# EAGLE design Audio_Mixer_MK2_prod (EAGLE 5.11)
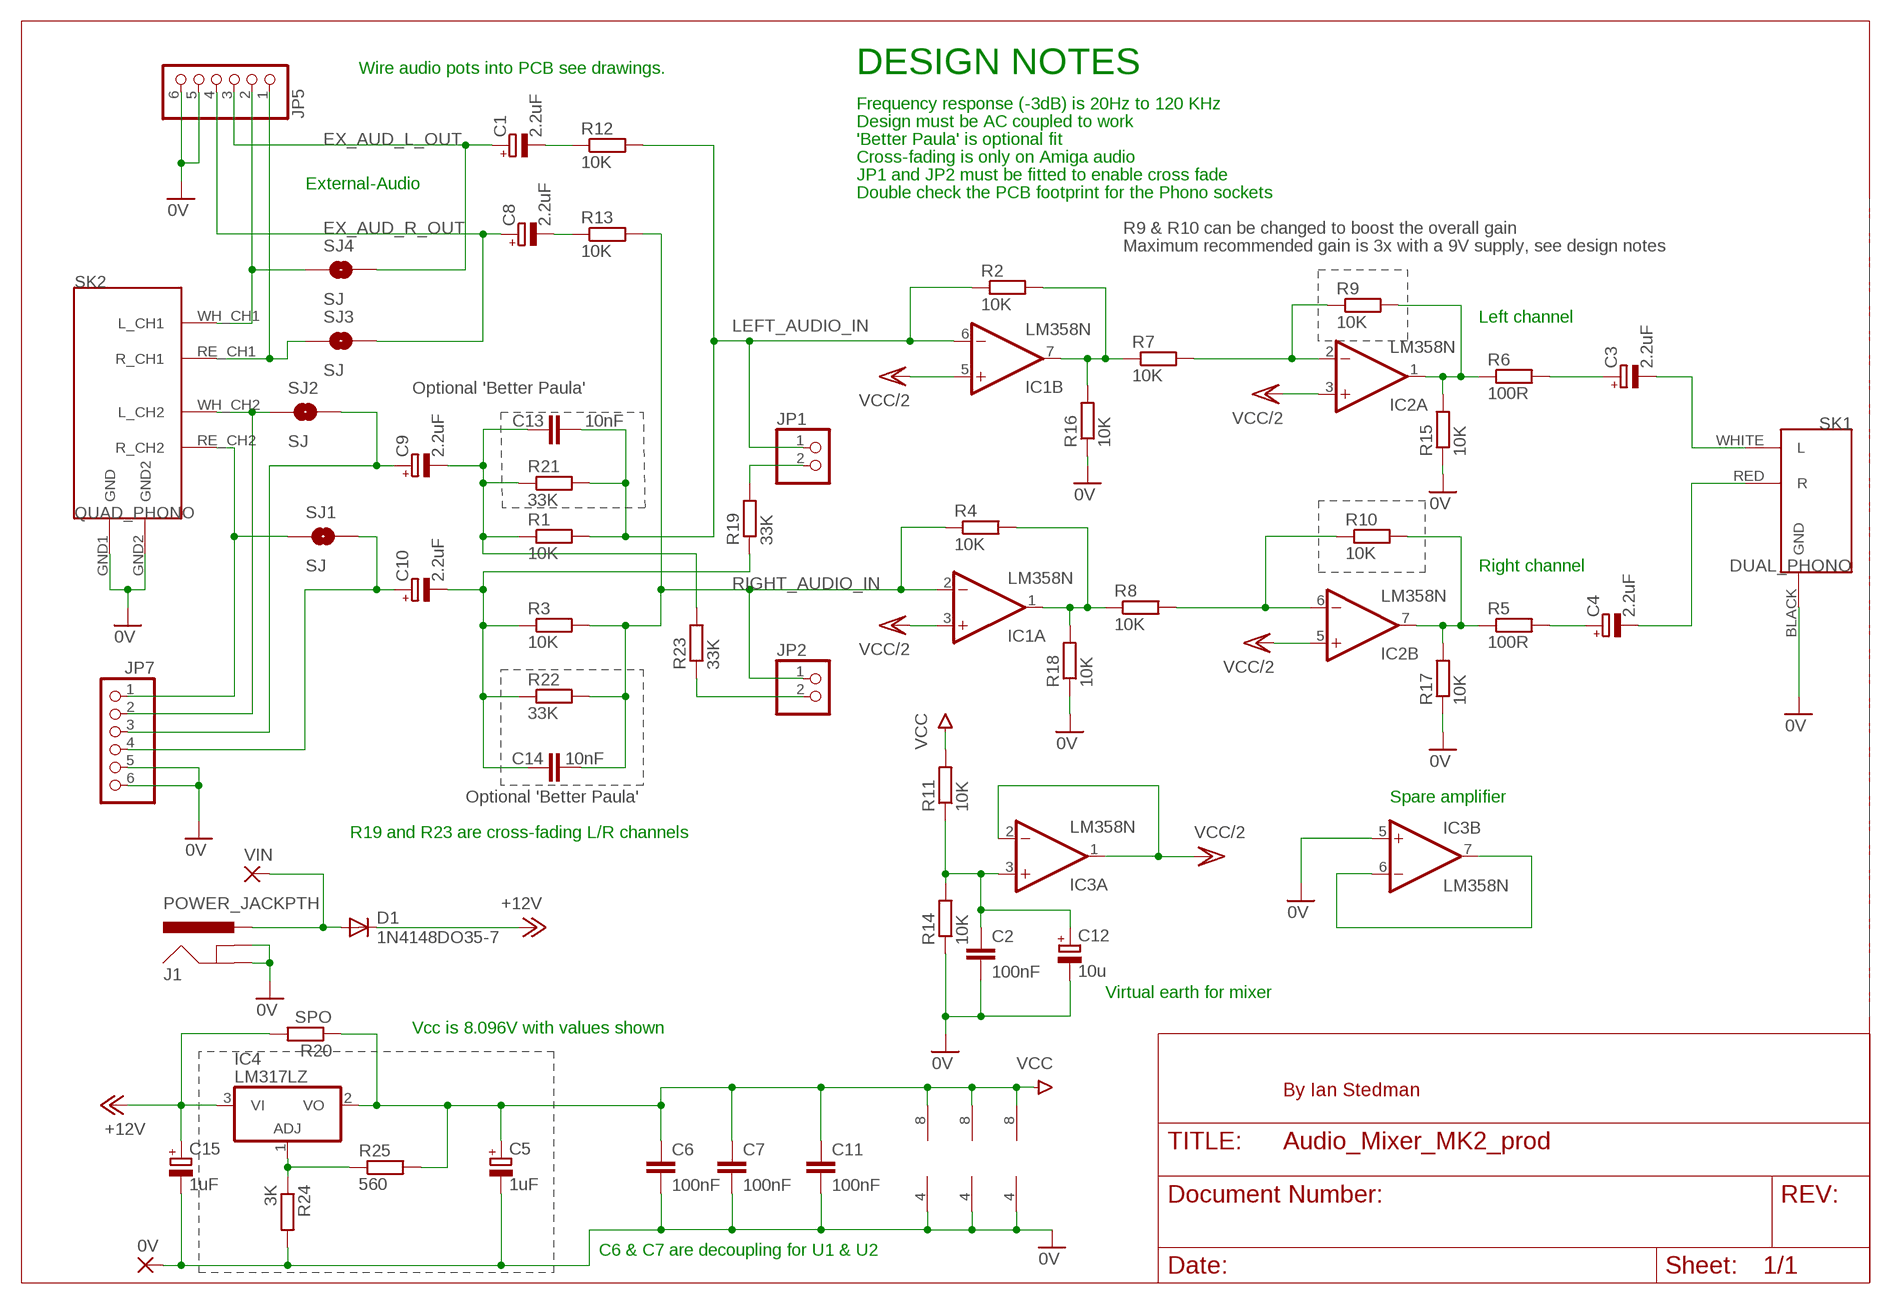
[diagram p0: schematic, sheet 1]

## Parts
0V  2,54/1,1  [2,54/1,1]
C1  2.2uF  CPOL-EUE2.5-5  [E2,5-5]
C2  100nF  C-EU050-025X075  [C050-025X075]
C3  2.2uF  CPOL-EUE2.5-5  [E2,5-5]
C4  2.2uF  CPOL-EUE2.5-5  [E2,5-5]
C5  1uF  CPOL-EUE2.5-5  [E2,5-5]
C6  100nF  C-EU050-025X075  [C050-025X075]
C7  100nF  C-EU050-025X075  [C050-025X075]
C8  2.2uF  CPOL-EUE2.5-5  [E2,5-5]
C9  2.2uF  CPOL-EUE2.5-5  [E2,5-5]
C10  2.2uF  CPOL-EUE2.5-5  [E2,5-5]
C11  100nF  C-EU050-025X075  [C050-025X075]
C12  10u  CPOL-EUE2.5-5  [E2,5-5]
C13  10nF  C-EU050-025X075  [C050-025X075]
C14  10nF  C-EU050-025X075  [C050-025X075]
C15  1uF  CPOL-EUE2.5-5  [E2,5-5]
D1  1N4148DO35-7  [DO35-7]
IC1  LM358N  [DIL08]
IC2  LM358N  [DIL08]
IC3  LM358N  [DIL08]
IC4  LM317LZ  [TO92]
J1  POWER_JACKPTH  [POWER_JACK_PTH]
JP1  PINHD-1X2  [1X02]
JP2  PINHD-1X2  [1X02]
JP5  PINHD-1X6  [1X06]
JP7  PINHD-1X6  [1X06]
R1  10K  R-EU_0207/7  [0207/7]
R2  10K  R-EU_0207/2V  [0207/2V]
R3  10K  R-EU_0207/7  [0207/7]
R4  10K  R-EU_0207/7  [0207/7]
R5  100R  R-EU_0207/7  [0207/7]
R6  100R  R-EU_0207/7  [0207/7]
R7  10K  R-EU_0207/7  [0207/7]
R8  10K  R-EU_0207/7  [0207/7]
R9  10K  R-EU_0207/7  [0207/7]
R10  10K  R-EU_0207/7  [0207/7]
R11  10K  R-EU_0207/7  [0207/7]
R12  10K  R-EU_0207/7  [0207/7]
R13  10K  R-EU_0207/7  [0207/7]
R14  10K  R-EU_0207/7  [0207/7]
R15  10K  R-EU_0207/7  [0207/7]
R16  10K  R-EU_0207/2V  [0207/2V]
R17  10K  R-EU_0207/7  [0207/7]
R18  10K  R-EU_0207/7  [0207/7]
R19  33K  R-EU_0204/7  [0204/7]
R20  SPO  R-EU_0207/7  [0207/7]
R21  33K  R-EU_0207/7  [0207/7]
R22  33K  R-EU_0207/7  [0207/7]
R23  33K  R-EU_0204/7  [0204/7]
R24  3K  R-EU_0207/7  [0207/7]
R25  560  R-EU_0207/7  [0207/7]
SJ1  SJ  SOLDERJUMPERNO  [SJ_2S-NO]
SJ2  SJ  SOLDERJUMPERNO  [SJ_2S-NO]
SJ3  SJ  SOLDERJUMPERNO  [SJ_2S-NO]
SJ4  SJ  SOLDERJUMPERNO  [SJ_2S-NO]
SK1  DUAL_PHONO  [DUAL_PHONO_PCB]
SK2  QUAD_PHONO  [QUAD_PHONO]
VIN  2,54/1,1  [2,54/1,1]

## Nets
0V: 0V.1(P) C2.2 C5.- C6.2 C7.2 C11.2 C12.- C15.- IC1.4(P:V-) IC2.4(P:V-) IC3.4(P:V-) IC3.5(B:+IN) J1.GND J1.GNDBREAK JP5.5 JP5.6 JP7.5 JP7.6 R14.1 R15.1 R16.1 R17.1 R18.1 R24.2 SK1.BLACK(GND) SK2.GND1(GND) SK2.GND2
+12V: C15.+ D1.C IC4.3(VI) R20.2
EX_AUD_L_OUT: C1.+ JP5.3 SJ4.2
EX_AUD_R_OUT: C8.+ JP5.4 SJ3.2
LEFT_AUDIO_IN: C13.2 IC1.6(B:-IN) JP1.1 R1.2 R2.1 R12.2 R21.2
N$1: C4.+ R5.2
N$2: C9.- C13.1 R1.1 R21.1 R23.2
N$3: IC2.7(B:OUT) R5.1 R10.2 R17.2
N$4: C10.- C14.1 R3.1 R19.1 R22.1
N$5: JP5.1 SJ3.1 SK2.RE_CH1(R_CH1)
N$6: IC2.1(A:OUT) R6.1 R9.2 R15.2
N$7: C3.- SK1.WHITE(L)
N$8: C4.- SK1.RED(R)
N$9: C3.+ R6.2
N$10: JP5.2 SJ4.1 SK2.WH_CH1(L_CH1)
N$11: C8.- R13.1
N$12: JP7.2 SJ2.1 SK2.WH_CH2(L_CH2)
N$13: IC1.1(A:OUT) R4.2 R8.1 R18.2
N$14: JP7.1 SJ1.1 SK2.RE_CH2(R_CH2)
N$15: IC2.6(B:-IN) R8.2 R10.1
N$16: IC1.7(B:OUT) R2.2 R7.1 R16.2
N$17: IC2.2(A:-IN) R7.2 R9.1
N$18: C1.- R12.1
N$19: C2.1 C12.+ IC3.3(A:+IN) R11.1 R14.2
N$20: D1.A J1.PWR VIN.1(P)
N$21: C9.+ JP7.3 SJ2.2
N$22: C10.+ JP7.4 SJ1.2
N$23: IC3.6(B:-IN) IC3.7(B:OUT)
N$24: JP2.2 R23.1
N$25: JP1.2 R19.2
N$26: IC4.1(ADJ) R24.1 R25.1
RIGHT_AUDIO_IN: C14.2 IC1.2(A:-IN) JP2.1 R3.2 R4.1 R13.2 R22.2
VCC: C5.+ C6.1 C7.1 C11.1 IC1.8(P:V+) IC2.8(P:V+) IC3.8(P:V+) IC4.2(VO) R11.2 R20.1 R25.2
VCC/2: IC1.3(A:+IN) IC1.5(B:+IN) IC2.3(A:+IN) IC2.5(B:+IN) IC3.1(A:OUT) IC3.2(A:-IN)

## Notes on the sheet
- Wire audio pots into PCB see drawings. | DESIGN NOTES
- Frequency response (-3dB) is 20Hz to 120 KHz
- Design must be AC coupled to work
- 'Better Paula' is optional fit
- Cross-fading is only on Amiga audio
- JP1 and JP2 must be fitted to enable cross fade
- External-Audio
- Double check the PCB footprint for the Phono sockets
- R9 & R10 can be changed to boost the overall gain
- Maximum recommended gain is 3x with a 9V supply, see design notes
- Left channel
- Optional 'Better Paula'
- Right channel
- Optional 'Better Paula' | Spare amplifier
- R19 and R23 are cross-fading L/R channels
- Virtual earth for mixer
- Vcc is 8.096V with values shown
- By Ian Stedman
- C6 & C7 are decoupling for U1 & U2

## Library data of the parts
0V VIN = wirepad:2,54/1,1: THROUGH-HOLE PAD
C1 C3-C5 C8-C10 C12 C15 = rcl:CPOL-EU: POLARIZED CAPACITOR, European symbol
C2 C6 C7 C11 C13 C14 = rcl:C-EU: CAPACITOR, European symbol
D1 = diode:1N4148: DIODE high speed (Philips)
IC1-IC3 = linear2:LM358: OP AMP
IC4 = linear:*317: Positive VOLTAGE REGULATOR
J1 = SparkFun:POWER_JACK: Power Jack This is the standard 5.5mm barrel jack for power. The PTH is the most common, proven, reliable, footprint. All others are experimental. The Slot footprint only works if the mill layer is transmitted to the PCB fab house so be warned. Spark Fun Electronics SKU : PRT-00119. Mating wall wart : TOL-00298 (and others)
JP1 JP2 = pinhead:PINHD-1X2: PIN HEADER
JP5 JP7 = pinhead:PINHD-1X6: PIN HEADER
R1-R25 = rcl:R-EU_: RESISTOR, European symbol
SJ1-SJ4 = SparkFun:SOLDERJUMPER: Solder Jumper Standard SMD solder jumper. Used to automate production. Two varients : Normally Open and Normally Closed are the same, but have different paste layers. NC will have a large amount of paste and should jumper during reflow.
SK1 = ians:DUAL_PHONO: Pro-Signal PSG01550 Dual input phono socket from Farnell/CPC
SK2 = ians:QUAD_PHONO: Pro-signal PSG01551 Quad phono Available from CPC/Farnell.

## Board
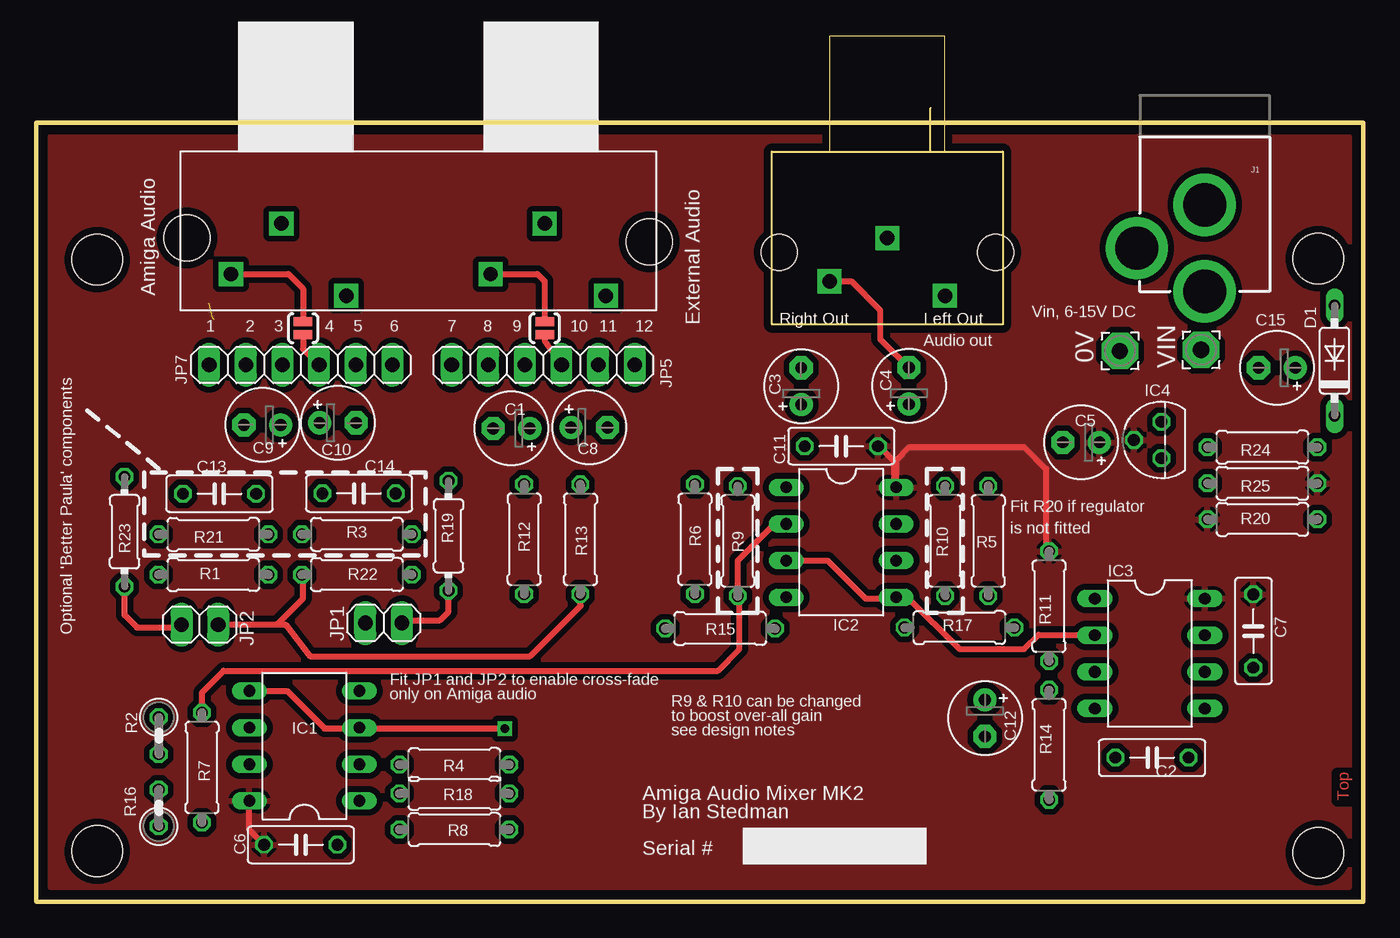
[diagram p1: board, top side]
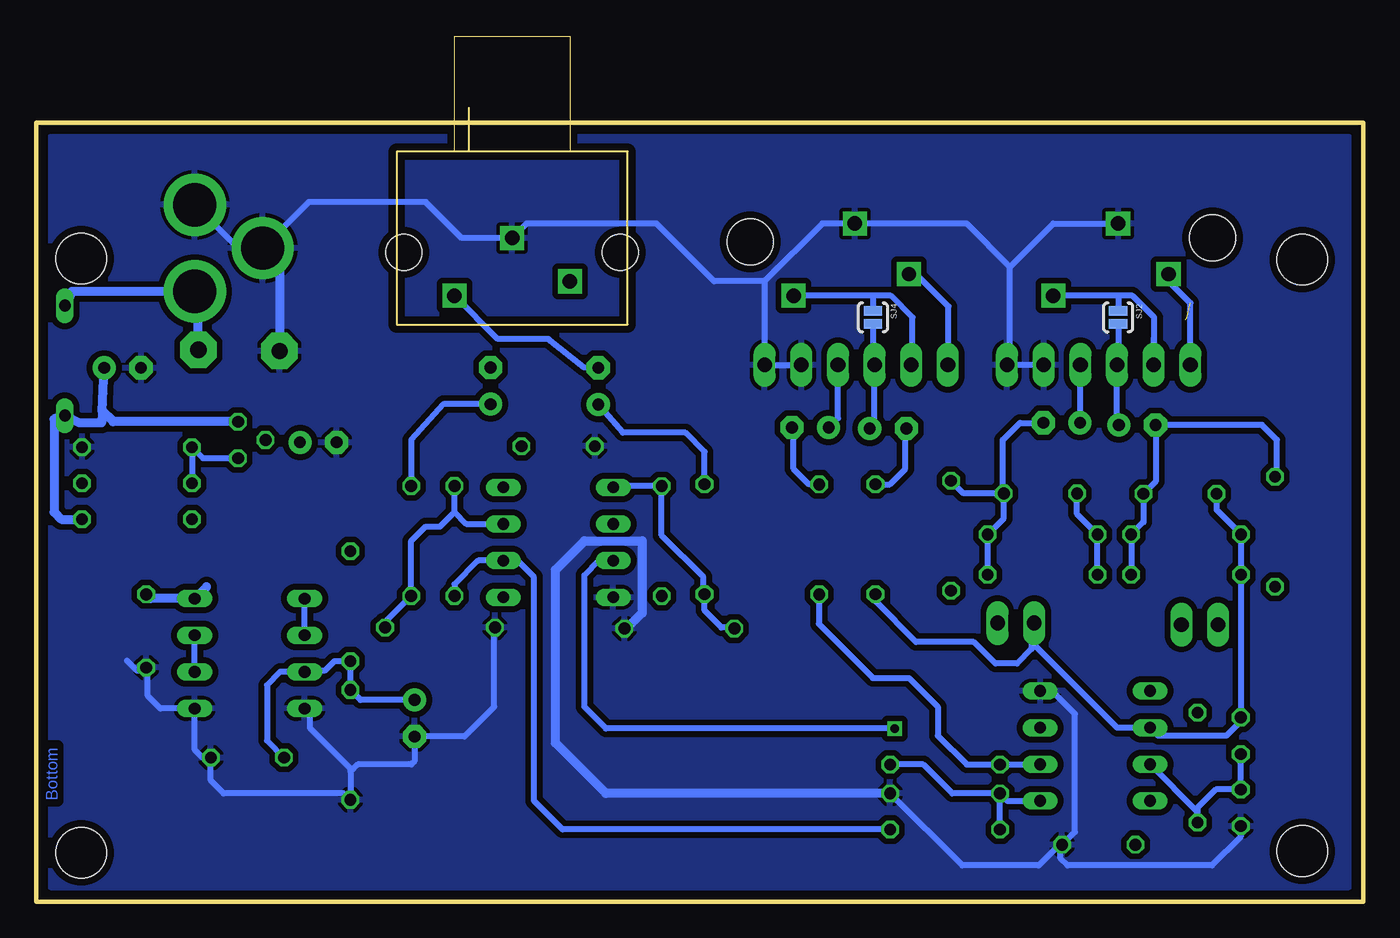
[diagram p2: board, bottom side, seen from below]

Size 92 x 54 mm. Coordinates in mm from the lower left corner, seen from the top.
Outline: 0,54 92,54 92,0 0,0 0,54
Copper layers (1*16): Top 0.035mm / dielectric 1.5mm / Bottom 0.035mm
Design rules "pcbtrainsmt": minimum track width 0.15mm, minimum drill 0.5mm, track to track 0.15mm, track to pad 0.15mm, pad to pad 0.15mm, via to via 0.15mm, smd to smd 0.15mm, copper to edge 0.5mm, drill to drill 0.5mm, minimum pad ring 5mil, minimum via ring 8mil, stop-mask expansion 0mil, vias tented up to drill 0mil, thermal gap 10mil
Holes 3.51 mm at 88.88,44.56 4.25,44.5 4.25,3.5 88.88,3.37

### Footprints (pad centres in the part's own frame; a part is rotated, then mirrored left to right if it is on the bottom)
2,54/1,1 = drill 1.118 pad 2.54 octagon: 1 0,0
E2,5-5 = drill 0.813 pad 1.6 round: + -1.27,0 | drill 0.813 pad 1.6 octagon: - 1.27,0
C050-025X075 = drill 0.813 octagon: 1 -2.54,0; 2 2.54,0
DO35-7 = drill 0.813 long: A 3.81,0; C -3.81,0
DIL08 = drill 0.813 long: 1 -3.81,-3.81; 2 -1.27,-3.81; 3 1.27,-3.81; 4 3.81,-3.81; 5 3.81,3.81; 6 1.27,3.81; 7 -1.27,3.81; 8 -3.81,3.81
TO92 = drill 0.813 octagon: 1 -1.27,0; 2 0,1.905; 3 1.27,0
POWER_JACK_PTH = drill 2.997 pad 4.318 round: GND 0,7.7; GNDBREAK 4.7,10.7; PWR 0,13.7
1X02 = drill 1.016 long: 1 -1.27,0; 2 1.27,0
1X06 = drill 1.016 long: 1 -6.35,0; 2 -3.81,0; 3 -1.27,0; 4 1.27,0; 5 3.81,0; 6 6.35,0
0207/7 = drill 0.813 octagon: 1 -3.81,0; 2 3.81,0
0207/2V = drill 0.813 octagon: 1 -1.27,0; 2 1.27,0
0204/7 = drill 0.813 octagon: 1 -3.81,0; 2 3.81,0
SJ_2S-NO = smd 0.635 x 1.27: 1 -0.45,0; 2 0.45,0
DUAL_PHONO_PCB = drill 1 pad 1.676 square: BLACK 0,1; RED 4,4; WHITE -4,5 | hole 2.5: 7.5,2; -7.5,2
QUAD_PHONO = drill 1 pad 1.676 square: GND1 -8.25,1; GND2 10,1; RE_CH1 -4.5,4.5; RE_CH2 13.5,4.5; WH_CH1 -12.5,6; WH_CH2 5.5,6 | hole 3.2: -15.51,2.27; 16.55,2

### Placement (x,y rotation side)
0V  75.13,38.17 0 top
C1  32.95,32.8 180 top
C2  77.35,9.98 0 top
C3  53.03,35.73 90 top
C4  60.5,35.75 90 top
C5  72.44,31.84 180 top
C6  18.34,3.94 0 top
C7  84.37,18.76 270 top
C8  38.34,32.87 0 top
C9  15.68,33.04 180 top
C10  20.91,33.19 0 top
C11  55.81,31.57 180 top
C12  65.77,12.71 270 top
C13  12.71,28.27 180 top
C14  22.39,28.3 180 top
C15  86,37 180 top
D1  90,37.5 90 top
IC1  18.59,10.79 90 top
IC2  55.81,24.91 270 top
IC3  77.19,17.2 270 top
IC4  78,32 90 top
J1  81,56 180 top
JP1  24.09,19.32 0 top
JP2  11.35,19.2 180 top
JP5  35.15,37.2 0 top
JP7  18.34,37.2 0 top
R1  12.29,22.66 180 top
R2  8.5,11.5 270 top
R3  22.23,25.45 180 top
R4  29,9.5 0 top
R5  66,25 90 top
R6  45.67,25.12 90 top
R7  11.5,9.3 90 top
R8  29,5 0 top
R9  48.64,25 90 top
R10  63,25 90 top
R11  70.21,20.48 90 top
R12  33.83,25.12 270 top
R13  37.73,25.11 270 top
R14  70.21,10.86 90 top
R15  47.41,18.93 180 top
R16  8.5,6.5 90 top
R17  64,19 0 top
R18  29,7.5 180 top
R19  28.59,25.36 270 top
R20  85,26.5 0 top
R21  12.29,25.45 180 top
R22  22.23,22.66 180 top
R23  6.13,25.64 90 top
R24  85,31.5 0 top
R25  85,29 0 top
SJ1  18.5,39.75 270 top
SJ2  17,40.5 270 bottom
SJ3  35.25,39.75 270 top
SJ4  34,40.5 270 bottom
SK1  59,47 180 top
SK2  27,48 180 top
VIN  80.75,38.25 90 top

### Tracks (layer width: path | path; a pad name or v marks a point on that pad's centre or on a via)
0V
  Bottom 0.406: 70.21,9 R14.1 70.66,7.5 79,7.5 79.89,8.39 C2.2 79.92,10 80.5,10 81,10.5 IC3.5 83.39,13.39 84.25,14.25 84.25,16.1 C7.2 84.59,16 85,16 85.72,16.71 | 70.21,9 70.21,9.21 73,12 73,13 IC3.4 | 70.21,9 69.71,9.5 66,9.5 65.77,9.73 C12.- 62.31,11.44 60.25,13.5 60.25,18.94 R17.1 | SK2.GND2 21.5,47 24.5,44 | 24.5,44 24.5,37.65 JP7.6 JP7.5 | 24.5,44 27.5,47 SK2.GND1 37.5,47 41.5,43 | 41.5,43 JP5.6 | JP5.6 JP5.5 | JP5.6 41.95,37.45 42,37.5 41.55,37.5 JP5.6 | R16.1 8.5,4.5 10.5,2.5 20.5,2.5 21,3 21,3.82 | 21,3.82 C6.2 20,4.82 20,13 21.6,14.6 IC1.4 | 41.5,43 45,43 49,47 58,47 SK1.BLACK 62.5,46 65,48.5 73.1,48.5 J1.GNDBREAK 78,45.3 J1.GND | 21,3.82 21.18,3.82 22.5,2.5 27.81,2.5 R18.1
  Bottom 0.61: J1.GNDBREAK 75.13,44.13 0V.1 75.5,38.17 | R18.1 52.5,7.5 56,11 56,23 54,25 50,25 50,20 51,19
  pour Bottom (isolate 0.406): 1,53 91,53 91,1 1,1
+12V
  Bottom 0.61: 87.42,34.02 87.46,33.19 89,33.19 D1.C 90.75,33.44 90.75,27 90.25,26.5 R20.2 | 87.42,34.02 C15.+ | IC4.3 86.67,33.27 87.42,34.02
EX_AUD_L_OUT
  Bottom 0.406: C1.+ 33.88,33.14 JP5.3 34,37.57 SJ4.2
EX_AUD_R_OUT
  Top 0.406: SJ3.2 35.25,38.87 JP5.4
  Bottom 0.406: JP5.4 36.42,33.52 C8.+
LEFT_AUDIO_IN
  Bottom 0.406: C13.2 10.17,27.15 R21.2 R1.2 8.47,13.2 R2.1 8.27,12.73 9.5,11.5 14.23,11.5 IC1.6 17.06,12.06 23,18 | R12.2 33.83,20.82 31,18 27,18 25.5,16.5 24,16.5 23,17.5 23,18 | 23,18 23,19.13 JP1.1
N$1
  Bottom 0.406: C4.+ 63.77,34.48 66,32 R5.2
N$2
  Bottom 0.406: R1.1 R21.1 15.25,26.3 C13.1 14.41,29.11 C9.- 7.04,33.04 6,32 6,29.59 R23.2
N$3
  Bottom 0.406: IC2.7 62.18,26.18 63,27 | R17.2 67.81,19.38 R5.1 66,25 65,26 64,26 63,27 | 63,27 R10.2
N$4
  Bottom 0.406: C10.- 23.81,33.19 25,32 25,28.37 C14.1 | C14.1 27.71,28.3 R19.1 | C14.1 24.93,26.58 R3.1 R22.1
N$5
  Top 0.406: SK2.RE_CH1 34.75,43.5 35.25,43 SJ3.1
  Bottom 0.406: SK2.RE_CH1 31,43.5 28.75,41.25 28.75,37.5 JP5.1
N$6
  Bottom 0.406: IC2.1 51.91,28.8 R9.2 48.64,25.39 45.75,22.5 45.75,21.39 R6.1 45.67,20.17 44.5,19 43.67,19 R15.2
N$7
  Bottom 0.406: C3.- 54.03,37.03 56.5,39 60,39 SK1.WHITE
N$8
  Top 0.406: C4.- 60.73,36.77 58.5,39 58.5,41 56.5,43 SK1.RED
N$9
  Bottom 0.406: R6.2 45.67,31.17 47,32.5 51.32,32.5 C3.+
N$10
  Bottom 0.406: 34,42 32.75,42 31.25,40.5 31.25,37.54 JP5.2 | 34,42 SK2.WH_CH1 | 34,42 SJ4.1
N$11
  Bottom 0.406: R13.1 38.42,28.92 39.5,30 39.5,32.76 C8.-
N$12
  Bottom 0.406: JP7.2 14.54,38 | 14.54,38 14.54,39.03 | 17,42 SK2.WH_CH2 | 14.54,38 14.5,38.03 14.5,40.5 16,42 17,42 | 17,42 SJ2.1
N$13
  Bottom 0.406: IC1.1 24.67,6.98 R18.2 | R8.1 R18.2 | R18.2 28.5,7.5 30.5,9.5 R4.2
N$14  (2 unrouted)
  Top 0.406: SK2.RE_CH2 17.5,43.5 18.5,42.5 SJ1.1
  Bottom 0.406: JP7.1 11.99,41.49 14,43.5 SK2.RE_CH2
N$15
  Bottom 0.406: R10.1 63,22 61.36,23.64 IC2.6 58.64,23.64 57.5,22.5 57.5,7 55.5,5 R8.2
N$16
  Bottom 0.406: R2.2 R16.2 10.23,7.77 11.5,6.5 R7.1 11.5,6.23 IC1.7
N$17
  Top 0.406: R7.2 11.5,14.5 13,16 47.25,16 48.75,17.5 48.75,21.07 R9.1 48.64,23.64 51,26 51.82,26 IC2.2
N$18
  Bottom 0.406: R12.1 32.82,28.93 31.75,30 31.75,32.73 C1.-
N$19
  Bottom 0.406: C2.1 76,11.16 76,15 75.08,15.93 IC3.3 73.31,16 72,16 71.33,16.66 R11.1 R14.2 69.52,13.98 C12.+
N$20
  Bottom 0.61: VIN.1 80.75,42.05 J1.PWR 89.51,42.3 D1.A
N$21
  Bottom 0.406: C9.+ 17.07,33.17 JP7.3 17,37.52 SJ2.2
N$22
  Top 0.406: SJ1.2 18.5,38.31 JP7.4
  Bottom 0.406: JP7.4 19.61,33.22 C10.+
N$23
  Bottom 0.406: IC3.6 IC3.7
N$24
  Top 0.406: R23.1 6.13,19.86 7,19 9.88,19 JP2.2
N$25
  Top 0.406: R19.2 28.59,20.09 28,19.5 25.54,19.5 JP1.2
N$26
  Bottom 0.406: IC4.1 80.42,30.73 R24.1 R25.1
RIGHT_AUDIO_IN
  Top 0.406: JP2.1 16.7,19.2 | 16.7,19.2 18.5,21 18.5,22.59 R22.2 18.43,22.93 18.5,23 | 16.7,19.2 17.3,19.2 19,17 34.25,17 37.75,20.5 37.75,21.27 R13.2
  Bottom 0.406: C14.2 19.84,26.88 R3.2 R22.2 | IC1.2 25.17,9.52 R4.1 27.5,9.5 29.5,11.5 29.5,13.5 31.5,15.5 34,15.5 37.75,19.25 37.75,21.27 R13.2
VCC
  Top 0.406: IC1.8 14.79,4.96 C6.1 | C11.1 58.68,31.32 59.5,30.5 59.5,28.84 IC2.8 59.62,30.62 60.5,31.5 68.5,31.5 70,30 70,24.5 R11.2
  Bottom 0.61: 80.19,21.82 IC3.8 84.08,21 C7.1
  pour Top (isolate 0.406): 1,53 91,53 91,1 1,1
VCC/2  (via drill 0.6)
  Top 0.406: IC1.5 17.4,14.6 20,12 22.34,12 IC1.3 22.46,12 v32.5,12 | IC3.2 73.35,18.5 69.5,18.5 68.5,17.5 64,17.5 60.4,21.1 IC2.5 59.52,21 57.5,21 54.86,23.64 IC2.3
  Bottom 0.406: IC3.2 IC3.1 | v32.5,12 52.5,12 54,13.5 54,22.64 53,23.64 IC2.3

### Text on the board
Top: Top
Bottom: Bottom
tPlace: Amiga Audio Mixer MK2 | By Ian Stedman | Serial #
tNames: Amiga Audio | Vin, 6-15V DC | External Audio | Right Out | Left Out | 1 | 2 | 3 | 4 | 5 | 6 | 7 | 8 | 9 | 10 | 11 | 12 | Audio out | Fit R20 if regulator | is not fitted | Optional 'Better Paula' components | Fit JP1 and JP2 to enable cross-fade | only on Amiga audio | R9 & R10 can be changed | to boost over-all gain | see design notes